# Altium schematic sheet AMR1.SchDoc
size A; SheetNumber: 1; SheetTotal: 1
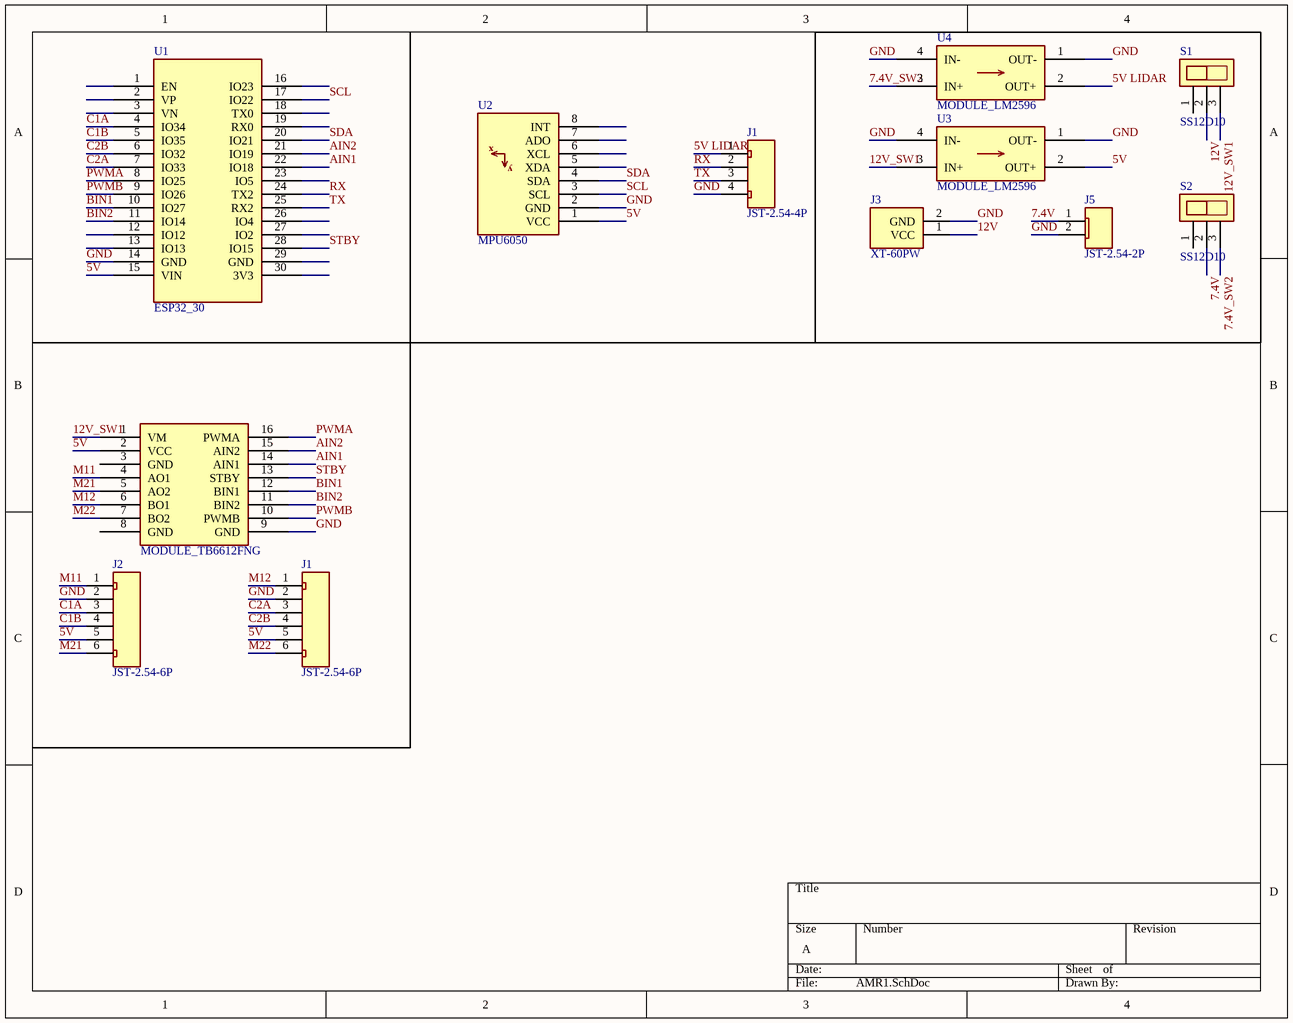
[diagram p0: AMR1.SchDoc]

## Parts
(Parts that share a designator on the sheet are numbered #1, #2 ... from top to bottom, then left to right.)
?  MODULE_TB6612FNG  [MODULE_TB6612FNG]
J1#1  JST-2.54-4P  [JST-2.54-4P]
J1#2  JST-2.54-6P  [JST-2.54-6P]
J2  JST-2.54-6P  [JST-2.54-6P]
J3  XT-60PW  [XT-60PW-Female]
J5  JST-2.54-2P  [JST-2.54-2P]
S1  SS12D10  [SS12D10]
S2  SS12D10  [SS12D10]
U1  ESP32_30  [ESP32_30]
U2  MPU6050  [MPU6050]
U3  MODULE_LM2596  [MODULE_LM2596]
U4  MODULE_LM2596  [MODULE_LM2596]

## Nets
5V: ?.2(VCC) J1#2.5 J2.5 U1.15(VIN) U2.1(VCC) U3.2(OUT+)
5V LIDAR: J1#1.1 U4.2(OUT+)
7.4V: J5.1 S2.2
7.4V_SW2: S2.3 U4.3(IN+)
12V: J3.1(VCC) S1.2
12V_SW1: ?.1(VM) S1.3 U3.3(IN+)
AIN1: ?.14(AIN1) U1.22(IO18)
AIN2: ?.15(AIN2) U1.21(IO19)
BIN1: ?.12(BIN1) U1.10(IO27)
BIN2: ?.11(BIN2) U1.11(IO14)
C1A: J2.3 U1.4(IO34)
C1B: J2.4 U1.5(IO35)
C2A: J1#2.3 U1.7(IO33)
C2B: J1#2.4 U1.6(IO32)
GND: ?.9(GND) J1#1.4 J1#2.2 J2.2 J3.2(GND) J5.2 U1.14(GND) U2.2(GND) U3.1(OUT-) U3.4(IN-) U4.1(OUT-) U4.4(IN-)
M11: ?.4(AO1) J2.1
M12: ?.6(BO1) J1#2.1
M21: ?.5(AO2) J2.6
M22: ?.7(BO2) J1#2.6
PWMA: ?.16(PWMA) U1.8(IO25)
PWMB: ?.10(PWMB) U1.9(IO26)
RX: J1#1.2 U1.24(TX2)
SCL: U1.17(IO22) U2.3(SCL)
SDA: U1.20(IO21) U2.4(SDA)
STBY: ?.13(STBY) U1.28(IO15)
TX: J1#1.3 U1.25(RX2)

Not connected (* = marked no-connect by the designer): ? 3(GND) 8(GND); S1 1; S2 1; U1 1(EN) 2(VP) 3(VN) 12(IO12) 13(IO13) 16(IO23) 18(TX0) 19(RX0) 23(IO5) 26(IO4) 27(IO2) 29(GND) 30(3V3); U2 5(XDA) 6(XCL) 7(ADO) 8(INT)

## Notes on the sheet
- (in symbol MPU6050) x; y

## Library data of the parts
? = MODULE_TB6612FNG: Module Dual Motor Driver 2.5-13.5V 3.2A Peak 21x18mm; ComponentLink1Description: Datasheet; ComponentLink1URL: https://www.mouser.com/datasheet/2/408/TB6612FNG_datasheet_en_20141001-708260.pdf
J1#1 = JST-2.54-4P: Female Connector JST 4 Vias, 2.54mm.
J1#2 J2 = JST-2.54-6P: Female Connector JST 6 Vias, 2.54mm.
J3 = XT-60PW: Power Connector XT-60PW, Male and Female.; JLCPCB PN F: C9900000737; JLCPCB PN M: C98732
J5 = JST-2.54-2P: Female Connector JST 2 Vias, 2.54mm.
S1 S2 = SS12D10: Vertical Slide Switch 3 Pins 6.7x12.7x6.4mm.; JLCPCB PN: C2887259
U1 = ESP32_30: Microcontoller Board 30 Pins Wifi 2.4GHz BLE 4.2 ESP32-WROOM-32D; ComponentLink1Description: Datasheet; ComponentLink1URL: https://www.mouser.com/datasheet/2/891/esp32_wroom_32d_esp32_wroom_32u_datasheet_en-1365844.pdf
U2 = MPU6050: IMU ACCEL/GYRO 3-AXIS I2C; ComponentLink1Description: Datasheet; ComponentLink1URL: https://invensense.tdk.com/wp-content/uploads/2015/02/MPU-6000-Datasheet1.pdf
U3 U4 = MODULE_LM2596: MODULE BUCK STEP DOWN 3A 43x20mm; ComponentLink1Description: Datasheet; ComponentLink1URL: https://www.ti.com/lit/ds/symlink/lm2596.pdf